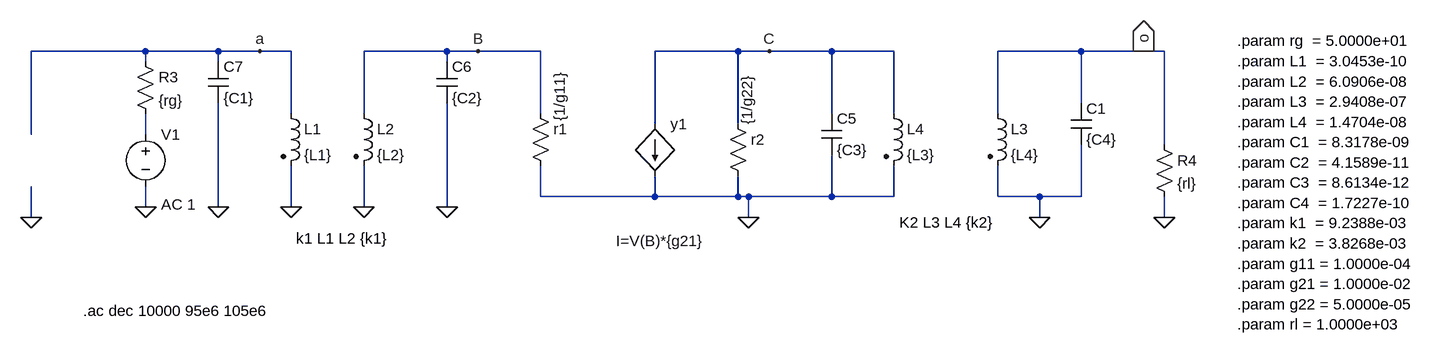
[diagram p0: schematic 20190701_circ.asc]
20190701_circ.asc, the LTspice schematic file:
Version 4
SHEET 1 1312 680
WIRE -672 -80 -848 -80
WIRE -560 -80 -672 -80
WIRE -496 -80 -560 -80
WIRE -448 -80 -496 -80
WIRE -208 -80 -336 -80
WIRE -160 -80 -208 -80
WIRE -64 -80 -160 -80
WIRE 240 -80 112 -80
WIRE 288 -80 240 -80
WIRE 384 -80 288 -80
WIRE 480 -80 384 -80
WIRE 768 -80 640 -80
WIRE 864 -80 768 -80
WIRE 896 -80 864 -80
WIRE -672 -64 -672 -80
WIRE -560 -64 -560 -80
WIRE -208 -64 -208 -80
WIRE 768 0 768 -80
WIRE -448 16 -448 -80
WIRE -336 16 -336 -80
WIRE -64 16 -64 -80
WIRE 384 16 384 -80
WIRE 480 16 480 -80
WIRE 640 16 640 -80
WIRE 112 32 112 -80
WIRE 240 32 240 -80
WIRE -848 48 -848 -80
WIRE -672 48 -672 16
WIRE 896 64 896 -80
WIRE -64 144 -64 96
WIRE 112 144 112 112
WIRE 112 144 -64 144
WIRE 240 144 240 112
WIRE 240 144 112 144
WIRE 256 144 240 144
WIRE 384 144 384 80
WIRE 384 144 256 144
WIRE 480 144 480 96
WIRE 480 144 384 144
WIRE 640 144 640 96
WIRE 704 144 640 144
WIRE 768 144 768 64
WIRE 768 144 704 144
WIRE -672 160 -672 128
WIRE -560 160 -560 0
WIRE -448 160 -448 96
WIRE -336 160 -336 96
WIRE -208 160 -208 0
WIRE -848 176 -848 128
WIRE 256 176 256 144
WIRE 704 176 704 144
WIRE 896 176 896 144
FLAG -448 160 0
FLAG -336 160 0
FLAG 704 176 0
FLAG -560 160 0
FLAG 256 176 0
FLAG 288 -80 C
FLAG -160 -80 B
FLAG 864 -80 o
IOPIN 864 -80 Out
FLAG 896 176 0
FLAG -848 176 0
FLAG -496 -80 a
FLAG -208 160 0
FLAG -672 160 0
SYMBOL ind2 -464 0 R0
SYMATTR InstName L1
SYMATTR Value {L1}
SYMATTR Type ind
SYMBOL ind2 -352 0 R0
SYMATTR InstName L2
SYMATTR Value {L2}
SYMATTR Type ind
SYMBOL res -80 0 R0
WINDOW 3 45 28 VLeft 2
SYMATTR Value {1/g11}
SYMATTR InstName r1
SYMBOL res 224 16 R0
WINDOW 3 30 17 VLeft 2
SYMATTR Value {1/g22}
SYMATTR InstName r2
SYMBOL bi 112 32 R0
WINDOW 3 -60 180 Left 2
SYMATTR Value I=V(B)*{g21}
SYMATTR InstName y1
SYMBOL ind2 624 0 R0
SYMATTR InstName L3
SYMATTR Value {L4}
SYMATTR Type ind
SYMBOL cap 368 16 R0
SYMATTR InstName C5
SYMATTR Value {C3}
SYMBOL cap -224 -64 R0
SYMATTR InstName C6
SYMATTR Value {C2}
SYMBOL res -688 -80 R0
SYMATTR InstName R3
SYMATTR Value {rg}
SYMBOL res 880 48 R0
SYMATTR InstName R4
SYMATTR Value {rl}
SYMBOL ind2 464 0 R0
SYMATTR InstName L4
SYMATTR Value {L3}
SYMATTR Type ind
SYMBOL cap -576 -64 R0
SYMATTR InstName C7
SYMATTR Value {C1}
SYMBOL cap 752 0 R0
SYMATTR InstName C1
SYMATTR Value {C4}
SYMBOL voltage -672 32 R0
WINDOW 123 24 124 Left 2
WINDOW 39 0 0 Left 0
SYMATTR InstName V1
SYMATTR Value ""
SYMATTR Value2 AC 1
TEXT -440 208 Left 2 !k1 L1 L2 {k1}
TEXT -768 320 Left 2 !.ac dec 10000 95e6 105e6
TEXT 488 184 Left 2 !K2 L3 L4 {k2}
TEXT 1008 -96 Left 2 !.param rg  = 5.0000e+01 \n.param L1  = 3.0453e-10 \n.param L2  = 6.0906e-08 \n.param L3  = 2.9408e-07 \n.param L4  = 1.4704e-08 \n.param C1  = 8.3178e-09 \n.param C2  = 4.1589e-11 \n.param C3  = 8.6134e-12 \n.param C4  = 1.7227e-10 \n.param k1  = 9.2388e-03 \n.param k2  = 3.8268e-03 \n.param g11 = 1.0000e-04 \n.param g21 = 1.0000e-02 \n.param g22 = 5.0000e-05 \n.param rl = 1.0000e+03

The netlist it stands for:
* 20190701_circ.asc
L1 a 0 {L1}
L2 B 0 {L2}
r1 B 0 {1/g11}
r2 C 0 {1/g22}
B§y1 C 0 I=V(B)*{g21}
L3 o 0 {L4}
C5 C 0 {C3}
C6 B 0 {C2}
R3 a N001 {rg}
R4 o 0 {rl}
L4 C 0 {L3}
C7 a 0 {C1}
C1 o 0 {C4}
V1 N001 0 AC 1
k1 L1 L2 {k1}
.ac dec 10000 95e6 105e6
K2 L3 L4 {k2}
.param rg  = 5.0000e+01
.param L1  = 3.0453e-10
.param L2  = 6.0906e-08
.param L3  = 2.9408e-07
.param L4  = 1.4704e-08
.param C1  = 8.3178e-09
.param C2  = 4.1589e-11
.param C3  = 8.6134e-12
.param C4  = 1.7227e-10
.param k1  = 9.2388e-03
.param k2  = 3.8268e-03
.param g11 = 1.0000e-04
.param g21 = 1.0000e-02
.param g22 = 5.0000e-05
.param rl = 1.0000e+03
.backanno
.end